# Altium schematic sheet lpGBT.SchDoc: lpGBT
size C; CheckedBy: Panagiotis Gkountoumis; DocumentNumber: 2; SheetNumber: 2; SheetTotal: 4
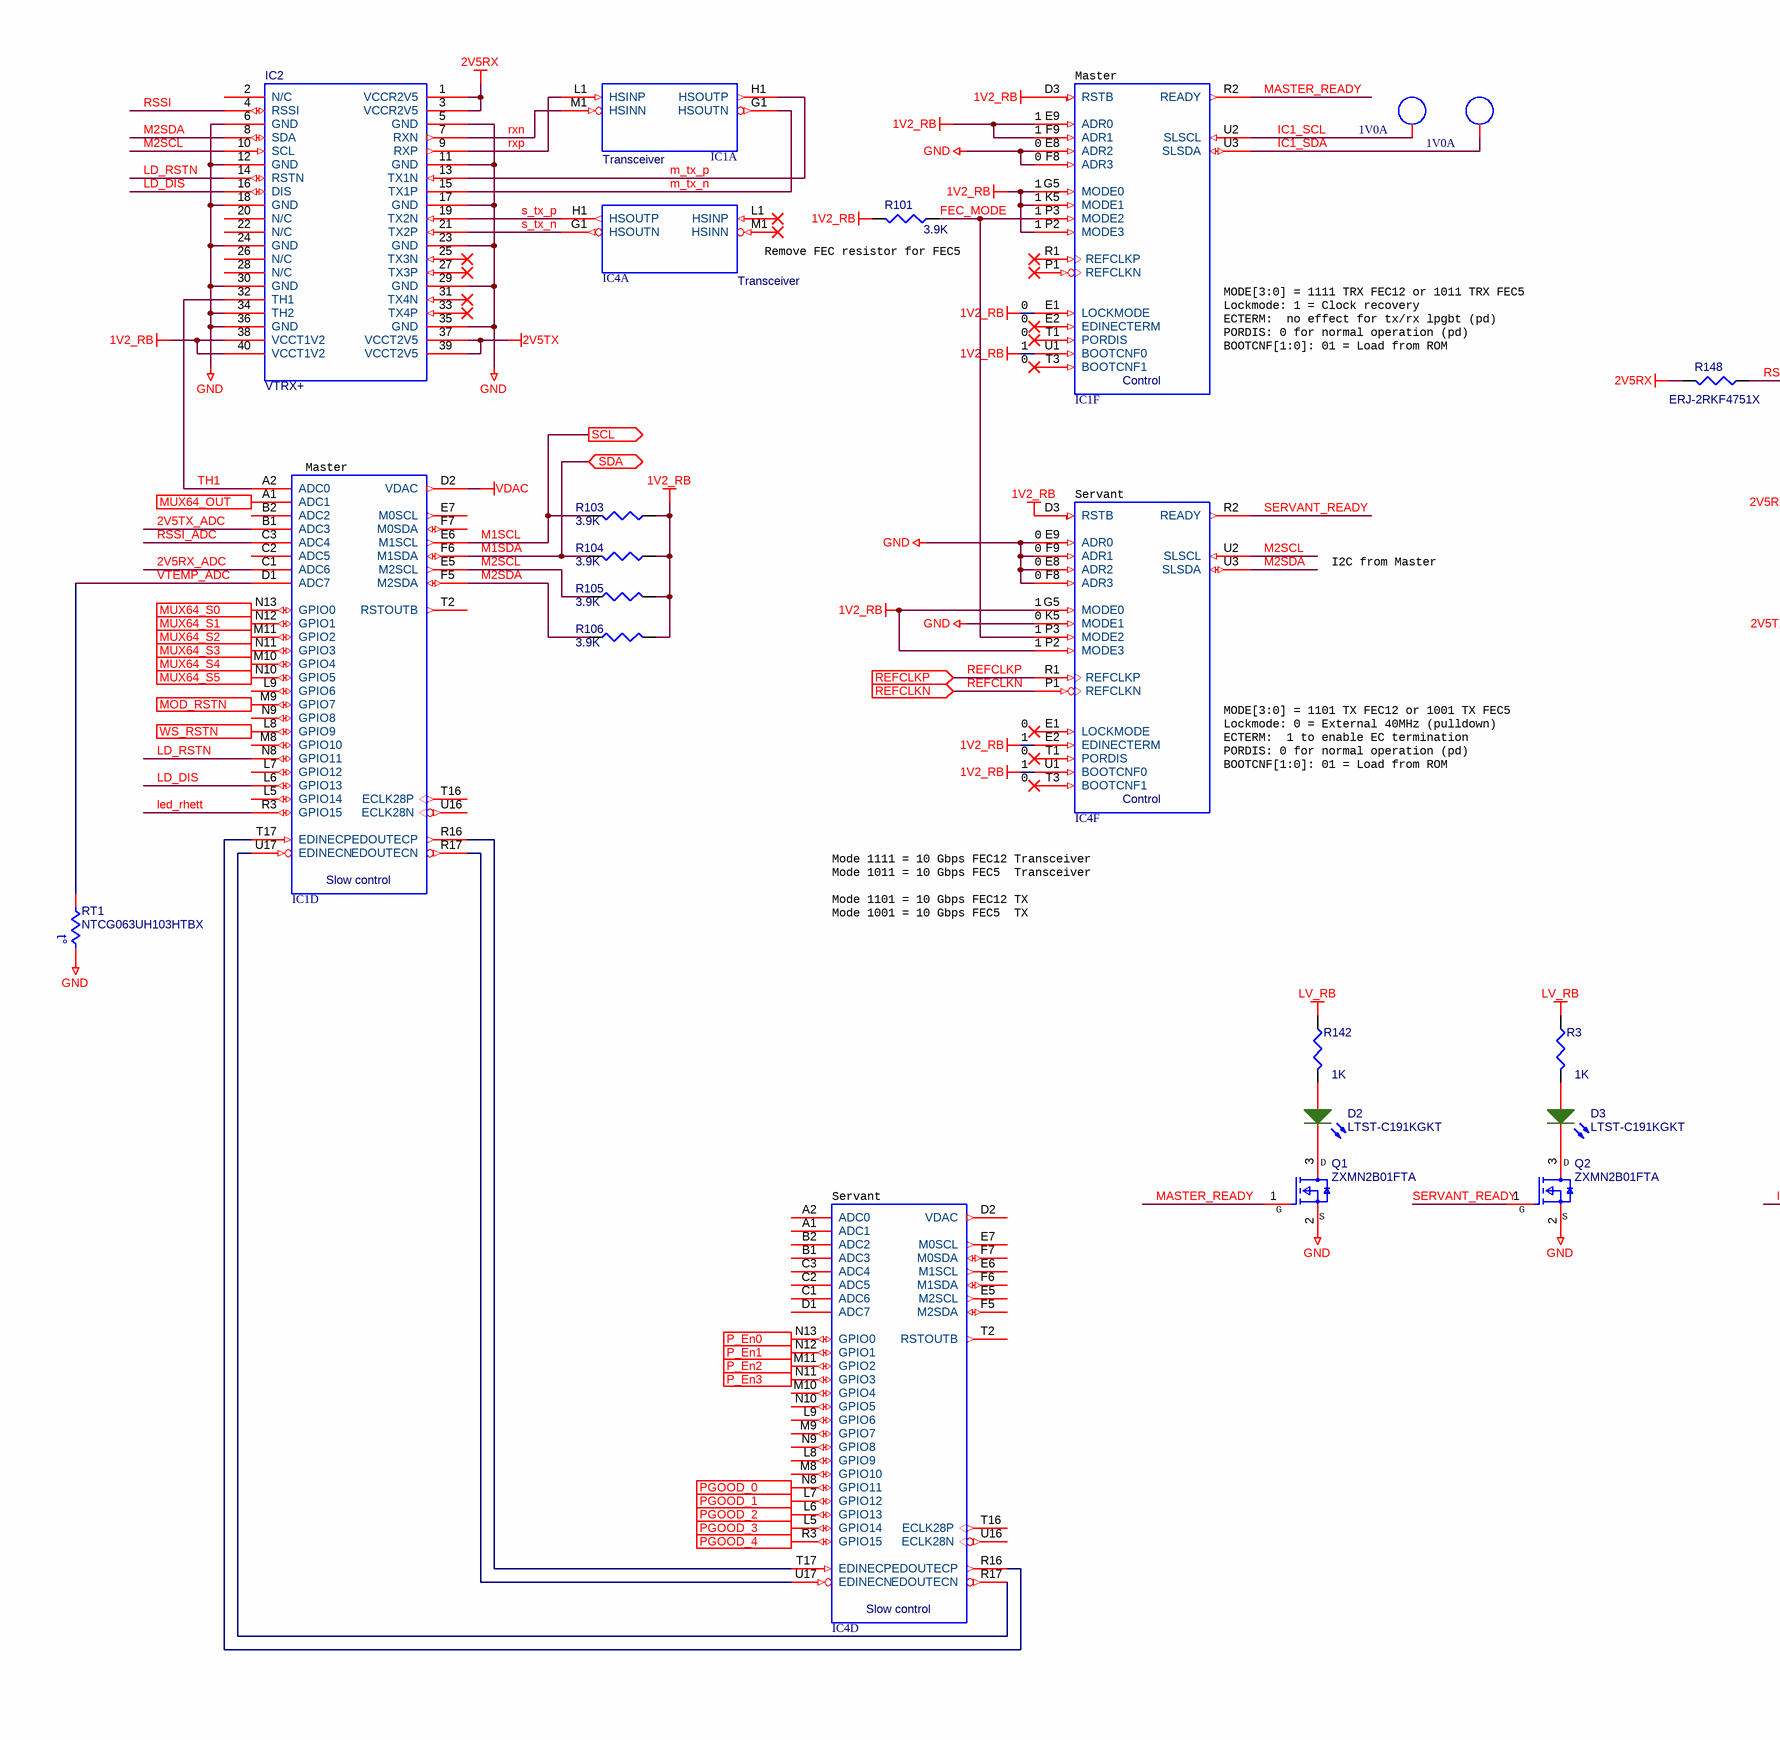
[diagram p0: lpGBT.SchDoc, left]
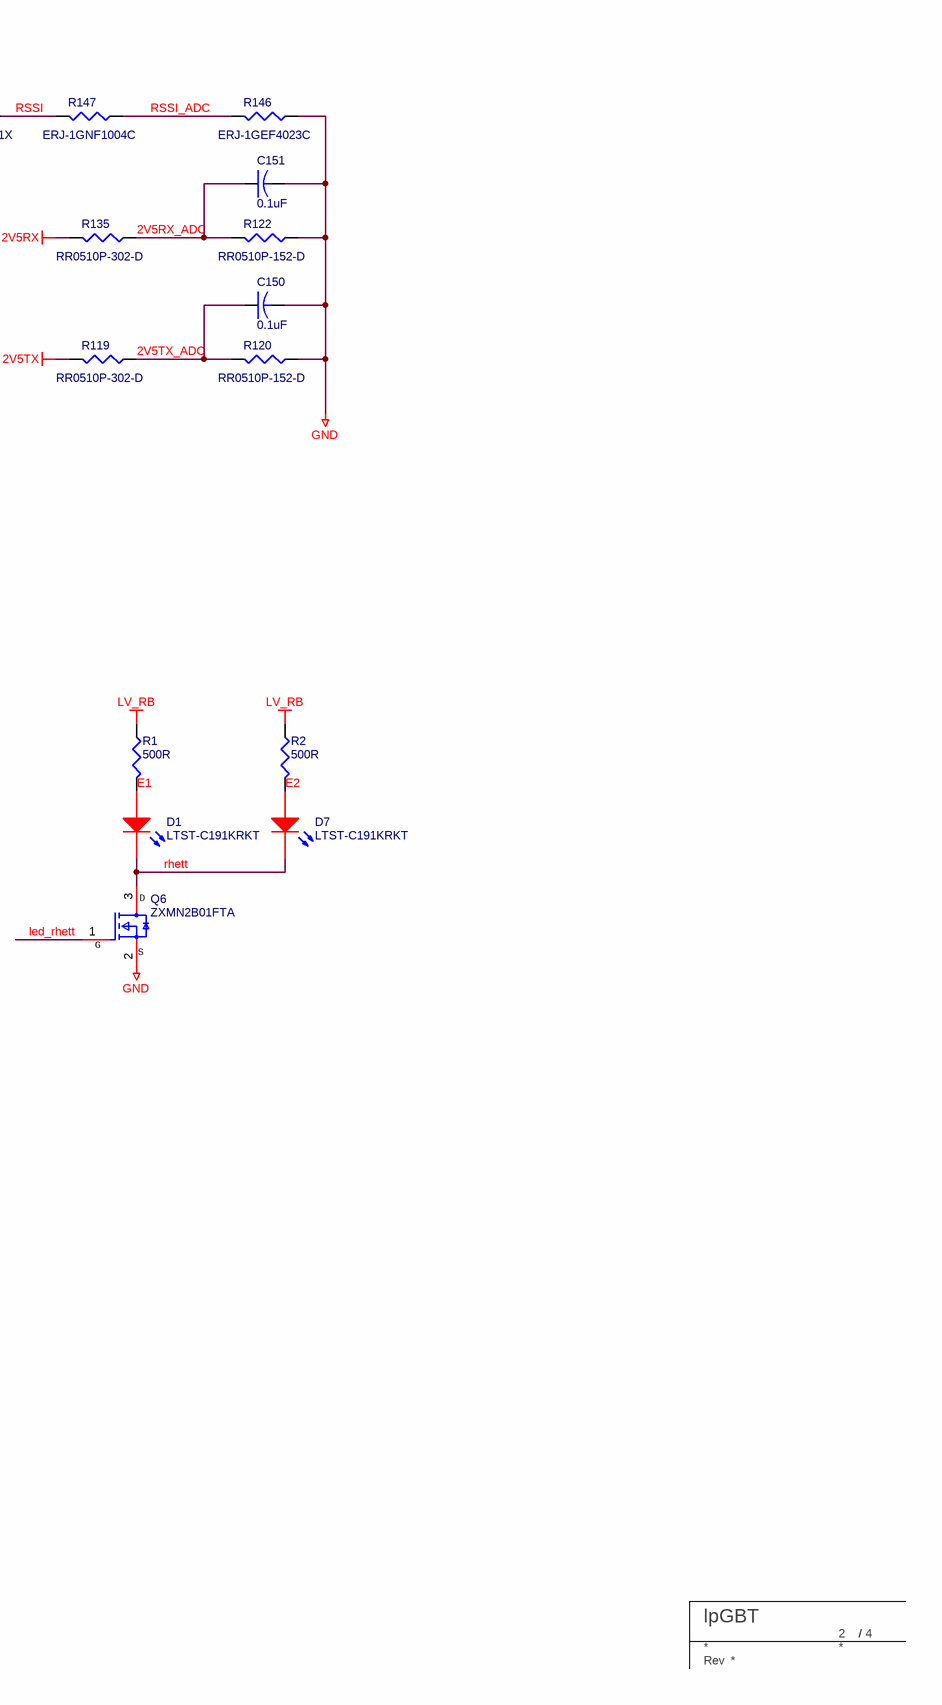
[diagram p1: lpGBT.SchDoc, right]

## Parts
C150  value 0.1uF  [capc1005n]  (hidden comment: GRM155R71E104ME14D)
C151  value 0.1uF  [capc1005n]  (hidden comment: GRM155R71E104ME14D)
D1  LTST-C191KRKT  [LED_RED]
D2  LTST-C191KGKT  [LED_RED]
D3  LTST-C191KGKT  [LED_RED]
D7  LTST-C191KRKT  [LED_RED]
IC1  LPGBT  [BGA289X17]  (value not drawn)  (parts A,D,F of 8)
IC2  DF40C-40DS-0.4V  [vtrx+]  (value not drawn)
IC4  LPGBT  [BGA289X17]  (value not drawn)  (parts A,D,F of 8)
Q1  ZXMN2B01FTA  [SOT-23]
Q2  ZXMN2B01FTA  [SOT-23]
Q6  ZXMN2B01FTA  [SOT-23]
R1  Parameter 1: 500R  [resc1005n]  (hidden comment: ERJ-2GEJ102X)
R2  Parameter 1: 500R  [resc1005n]  (hidden comment: ERJ-2GEJ102X)
R3  Parameter 1: 1K  [resc1005n]  (hidden comment: ERJ-2GEJ102X)
R101  Parameter 1: 3.9K  [resc1005n]  (hidden comment: ERJ-2GEJ392X)
R103  Parameter 1: 3.9K  [resc1005n]  (hidden comment: ERJ-2GEJ392X)
R104  Parameter 1: 3.9K  [resc1005n]  (hidden comment: ERJ-2GEJ392X)
R105  Parameter 1: 3.9K  [resc1005n]  (hidden comment: ERJ-2GEJ392X)
R106  Parameter 1: 3.9K  [resc1005n]  (hidden comment: ERJ-2GEJ392X)
R119  RR0510P-302-D  [resc1005n]
R120  RR0510P-152-D  [resc1005n]
R122  RR0510P-152-D  [resc1005n]
R135  RR0510P-302-D  [resc1005n]
R142  Parameter 1: 1K  [resc1005n]  (hidden comment: ERJ-2GEJ102X)
R146  ERJ-1GEF4023C  [resc0603]
R147  ERJ-1GNF1004C  [resc0603]
R148  ERJ-2RKF4751X  [resc1005n]
RT1  NTCG063UH103HTBX  [resc0603]
TBLOCK?  BU Title block  (value not drawn)  (graphical)
TP11  1V0A  [TESTPOINT]  (no BOM)
TP12  1V0A  [TESTPOINT]  (no BOM)

## Ports
MOD_RSTN (out), MUX64_OUT (in), MUX64_S0 (out), MUX64_S1 (out), MUX64_S2 (out), MUX64_S3 (out), MUX64_S4 (out), MUX64_S5 (out), P_En0 (out), P_En1 (out), P_En2 (out), P_En3 (out), PGOOD_0 (in), PGOOD_1 (in), PGOOD_2 (in), PGOOD_3 (in), PGOOD_4 (in), REFCLKN (in), REFCLKP (in), SCL (out), SDA (bidir), WS_RSTN (out)

## Nets
1V2_RB: IC1.D3(RSTB) IC1.E1(LOCKMODE) IC1.E9(ADR0) IC1.F9(ADR1) IC1.G5(MODE0) IC1.K5(MODE1) IC1.P2(MODE3) IC1.U1(BOOTCNF0) IC2.38(VCCT1V2) IC2.40(VCCT1V2) IC4.D3(RSTB) IC4.E2(EDINECTERM) IC4.G5(MODE0) IC4.P2(MODE3) IC4.U1(BOOTCNF0) R101.2 R103.1 R104.1 R105.2 R106.2
2V5RX: IC2.1(VCCR2V5) IC2.3(VCCR2V5) R135.2 R148.2
2V5TX: IC2.37(VCCT2V5) IC2.39(VCCT2V5) R119.2
GND: C150.2 C151.2 IC1.E8(ADR2) IC1.F8(ADR3) IC2.5(GND) IC2.6(GND) IC2.11(GND) IC2.12(GND) IC2.17(GND) IC2.18(GND) IC2.23(GND) IC2.24(GND) IC2.29(GND) IC2.30(GND) IC2.34(TH2) IC2.35(GND) IC2.36(GND) IC4.E8(ADR2) IC4.E9(ADR0) IC4.F8(ADR3) IC4.F9(ADR1) IC4.K5(MODE1) Q1.2(Source) Q2.2(Source) Q6.2(Source) R120.1 R122.1 R146.1 RT1.1
LV_RB: R1.1 R2.1 R3.1 R142.1
VDAC: IC1.D2(VDAC)
2V5RX_ADC: C151.1 IC1.C1(ADC6) R122.2 R135.1
2V5TX_ADC: C150.1 IC1.B1(ADC3) R119.1 R120.2
E1: D1.1(A) R1.2
E2: D7.1(A) R2.2
FEC_MODE: IC1.P3(MODE2) IC4.P3(MODE2) R101.1
IC1_SCL: IC1.U2(SLSCL) TP11.1(TP)
IC1_SDA: IC1.U3(SLSDA) TP12.1(TP)
LD_DIS: IC1.L6(GPIO13) IC2.16(DIS)
LD_RSTN: IC1.N8(GPIO11) IC2.14(RSTN)
led_rhett: IC1.R3(GPIO15) Q6.1(Gate)
M1SCL: IC1.E6(M1SCL) R103.2 ; port SCL
M1SDA: IC1.F6(M1SDA) R104.2 ; port SDA
M2SCL: IC1.E5(M2SCL) IC2.10(SCL) IC4.U2(SLSCL) R105.1
M2SDA: IC1.F5(M2SDA) IC2.8(SDA) IC4.U3(SLSDA) R106.1
m_tx_n: IC1.G1(HSOUTN) IC2.15(TX1P)
m_tx_p: IC1.H1(HSOUTP) IC2.13(TX1N)
MASTER_READY: IC1.R2(READY) Q1.1(Gate)
MOD_RSTN: IC1.M9(GPIO7) ; port MOD_RSTN
MUX64_OUT: IC1.A1(ADC1) ; port MUX64_OUT
MUX64_S0: IC1.N13(GPIO0) ; port MUX64_S0
MUX64_S1: IC1.N12(GPIO1) ; port MUX64_S1
MUX64_S2: IC1.M11(GPIO2) ; port MUX64_S2
MUX64_S3: IC1.N11(GPIO3) ; port MUX64_S3
MUX64_S4: IC1.M10(GPIO4) ; port MUX64_S4
MUX64_S5: IC1.N10(GPIO5) ; port MUX64_S5
P_En0: IC4.N13(GPIO0) ; port P_En0
P_En1: IC4.N12(GPIO1) ; port P_En1
P_En2: IC4.M11(GPIO2) ; port P_En2
P_En3: IC4.N11(GPIO3) ; port P_En3
PGOOD_0: IC4.N8(GPIO11) ; port PGOOD_0
PGOOD_1: IC4.L7(GPIO12) ; port PGOOD_1
PGOOD_2: IC4.L6(GPIO13) ; port PGOOD_2
PGOOD_3: IC4.L5(GPIO14) ; port PGOOD_3
PGOOD_4: IC4.R3(GPIO15) ; port PGOOD_4
REFCLKN: IC4.P1(REFCLKN) ; port REFCLKN
REFCLKP: IC4.R1(REFCLKP) ; port REFCLKP
rhett: D1.2(K) D7.2(K) Q6.3(Drain)
RSSI: IC2.4(RSSI) R147.2 R148.1
RSSI_ADC: IC1.C3(ADC4) R146.2 R147.1
rxn: IC1.M1(HSINN) IC2.7(RXN)
rxp: IC1.L1(HSINP) IC2.9(RXP)
s_tx_n: IC2.21(TX2P) IC4.G1(HSOUTN)
s_tx_p: IC2.19(TX2N) IC4.H1(HSOUTP)
SERVANT_READY: IC4.R2(READY) Q2.1(Gate)
TH1: IC1.A2(ADC0) IC2.32(TH1)
VTEMP_ADC: IC1.D1(ADC7) RT1.2
WS_RSTN: IC1.L8(GPIO9) ; port WS_RSTN
NetD2_1: D2.1(A) R142.2
NetD2_2: D2.2(K) Q1.3(Drain)
NetD3_1: D3.1(A) R3.2
NetD3_2: D3.2(K) Q2.3(Drain)
NetIC1_R16: IC1.R16(EDOUTECP) IC4.T17(EDINECP)
NetIC1_R17: IC1.R17(EDOUTECN) IC4.U17(EDINECN)
NetIC1_T17: IC1.T17(EDINECP) IC4.R16(EDOUTECP)
NetIC1_U17: IC1.U17(EDINECN) IC4.R17(EDOUTECN)

Not connected (* = marked no-connect by the designer): IC1 B2(ADC2) C2(ADC5) E2(EDINECTERM)* E7(M0SCL) F7(M0SDA) L5(GPIO14) L7(GPIO12) L9(GPIO6) M8(GPIO10) N9(GPIO8) P1(REFCLKN)* R1(REFCLKP)* T1(PORDIS)* T2(RSTOUTB) T3(BOOTCNF1)* T16(ECLK28P) U16(ECLK28N); IC2 2(N/C) 20(N/C) 22(N/C) 25(TX3N)* 26(N/C) 27(TX3P)* 28(N/C) 31(TX4N)* 33(TX4P)*; IC4 A1(ADC1) A2(ADC0) B1(ADC3) B2(ADC2) C1(ADC6) C2(ADC5) C3(ADC4) D1(ADC7) D2(VDAC) E1(LOCKMODE)* E5(M2SCL) E6(M1SCL) E7(M0SCL) F5(M2SDA) F6(M1SDA) F7(M0SDA) L1(HSINP)* L8(GPIO9) L9(GPIO6) M1(HSINN)* M8(GPIO10) M9(GPIO7) M10(GPIO4) N9(GPIO8) N10(GPIO5) T1(PORDIS)* T2(RSTOUTB) T3(BOOTCNF1)* T16(ECLK28P) U16(ECLK28N)

## Notes on the sheet
- (near IC1) Master
- (near IC1) 1
- (near IC1) 0
- Remove FEC resistor for FEC5
- (near IC1) Lockmode: 1 = Clock recovery
- (near IC1) MODE[3:0] = 1111 TRX FEC12 or 1011 TRX FEC5
- (near IC1) ECTERM:  no effect for tx/rx lpgbt (pd)
- (near IC1) PORDIS: 0 for normal operation (pd)
- (near IC1) BOOTCNF[1:0]: 01 = Load from ROM
- (near IC4) Servant
- (near IC4) 0
- I2C from Master
- (near IC4) 1
- (near IC4) MODE[3:0] = 1101 TX FEC12 or 1001 TX FEC5
- (near IC4) Lockmode: 0 = External 40MHz (pulldown)
- (near IC4) ECTERM:  1 to enable EC termination
- (near IC4) PORDIS: 0 for normal operation (pd)
- (near IC4) BOOTCNF[1:0]: 01 = Load from ROM
- Mode 1111 = 10 Gbps FEC12 Transceiver
- Mode 1011 = 10 Gbps FEC5  Transceiver
- Mode 1101 = 10 Gbps FEC12 TX
- Mode 1001 = 10 Gbps FEC5  TX
- (in symbol LPGBT, part A) Transceiver
- (in symbol LPGBT, part D) Slow control
- (in symbol LPGBT, part F) Control
- (in symbol Res Thermal) t°
- (in symbol TITLE_BLOCK_BU) /; Rev
- (in symbol ZXMN2B01FTA) D; G; S

## Library data of the parts
C150 C151 = C: CERAMIC CAPACITOR
D1 D7 = LED_RED: Typical RED, GREEN, YELLOW, AMBER GaAs LED; Published: 8-Jun-2000; LatestRevisionDate: 17-Jul-2002; LatestRevisionNote: Re-released for DXP Platform.; PackageVersion: Feb-2002; PackageReference: 3.2X1.6X1.1; Publisher: Altium Limited; PackageDescription: SM LED; 2 Flat Leads
D2 D3 = LED_GREEN: Typical RED, GREEN, YELLOW, AMBER GaAs LED; Published: 8-Jun-2000; LatestRevisionDate: 17-Jul-2002; LatestRevisionNote: Re-released for DXP Platform.; PackageVersion: Feb-2002; PackageReference: 3.2X1.6X1.1; Publisher: Altium Limited; PackageDescription: SM LED; 2 Flat Leads
IC1 IC4 = LPGBT: Low Power Gigabit Transceiver; Manufacturer: CERN; Pinout Version: 180226; Bonding: No; Device: LPGBT; Manufacturer Part Number: LPGBT; SMD: Yes; Mounted: Yes; LatestRevisionDate: 26.10.2018; PackageDescription: BGA, 289-Leads, Body 9.00x9.00mmx1.28mm, Pitch 0.50mm; Part Description: Low Power Gigabit Transceiver; Case: BGA289; Part Number: LPGBT; Pin Count: 289; Socket: No; Component Kind: Standard; Component Type: Standard; Footprint: BGA289C50P17X17_900X900X128
IC2 = VTRX+_DF40C-2.0-40DS-0.4V: VTRX+ module with 2.5mm stack Height.; Parameter 1: VTRX+
Q1 Q2 Q6 = ZXMN2B01FTA: MOSFET N-CH 20V 2.1A SOT-23-3; ComponentLink2Description: Datasheet; ComponentLink2URL: https://www.diodes.com/assets/Datasheets/ZXMN2B01F.pdf
R1-R3 R101 R103 R104 R142 = R1: FILM RESISTOR; Text Field2: 5%
R105 R106 R119 R120 R122 R135 = R1: FILM RESISTOR; Text Field2: 1%
R146 = R1: FILM RESISTOR; Text Field2: 1%; Parameter 1: 402K
R147 = R1: FILM RESISTOR; Text Field2: 1%; Parameter 1: 1M
R148 = R1: FILM RESISTOR; Text Field2: 1%; Parameter 1: 4.75K
RT1 = Res Thermal: Thermistor; Published: 24-Mar-1999; LatestRevisionDate: 29-May-2009; LatestRevisionNote: IPC-7351 Footprint Added.; PackageVersion: Mar-2003; PackageReference: 6-0805; Publisher: Altium Limited; PackageDescription: Chip Resistor 0805 Case Size; Code_IPC: RESC2012
TBLOCK? = TITLE_BLOCK_BU
TP11 TP12 = TP: TEST POINT 40MIL DIA.